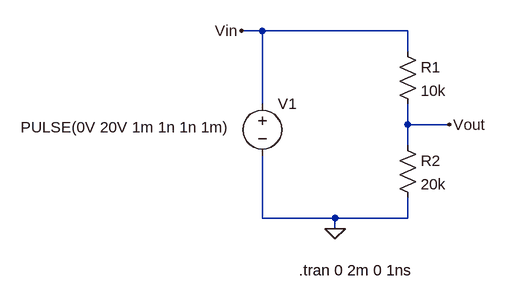
[diagram p0: schematic Voltage_Divider_Step_Response.asc]
Voltage_Divider_Step_Response.asc, the LTspice schematic file:
Version 4
SHEET 1 880 680
WIRE -32 -64 -64 -64
WIRE 192 -64 -32 -64
WIRE 192 -32 192 -64
WIRE -32 48 -32 -64
WIRE 192 80 192 48
WIRE 256 80 192 80
WIRE 192 112 192 80
WIRE -32 224 -32 128
WIRE 80 224 -32 224
WIRE 192 224 192 192
WIRE 192 224 80 224
WIRE 80 240 80 224
FLAG 80 240 0
FLAG -64 -64 Vin
FLAG 256 80 Vout
SYMBOL res 176 -48 R0
SYMATTR InstName R1
SYMATTR Value 10k
SYMATTR SpiceLine tol=5
SYMBOL voltage -32 32 R0
WINDOW 3 -372 52 Left 2
WINDOW 123 0 0 Left 0
WINDOW 39 0 0 Left 0
SYMATTR InstName V1
SYMATTR Value PULSE(0V 20V 1m 1n 1n 1m)
SYMBOL res 176 96 R0
SYMATTR InstName R2
SYMATTR Value 20k
SYMATTR SpiceLine tol=5
TEXT 24 304 Left 2 !.tran 0 2m 0 1ns

The netlist it stands for:
* Voltage_Divider_Step_Response.asc
R1 Vin Vout 10k tol=5
V1 Vin 0 PULSE(0V 20V 1m 1n 1n 1m)
R2 Vout 0 20k tol=5
.tran 0 2m 0 1ns
.backanno
.end